# EAGLE design rapidshark-lipo-sensor-mk-1.1 (EAGLE 6.5.0)
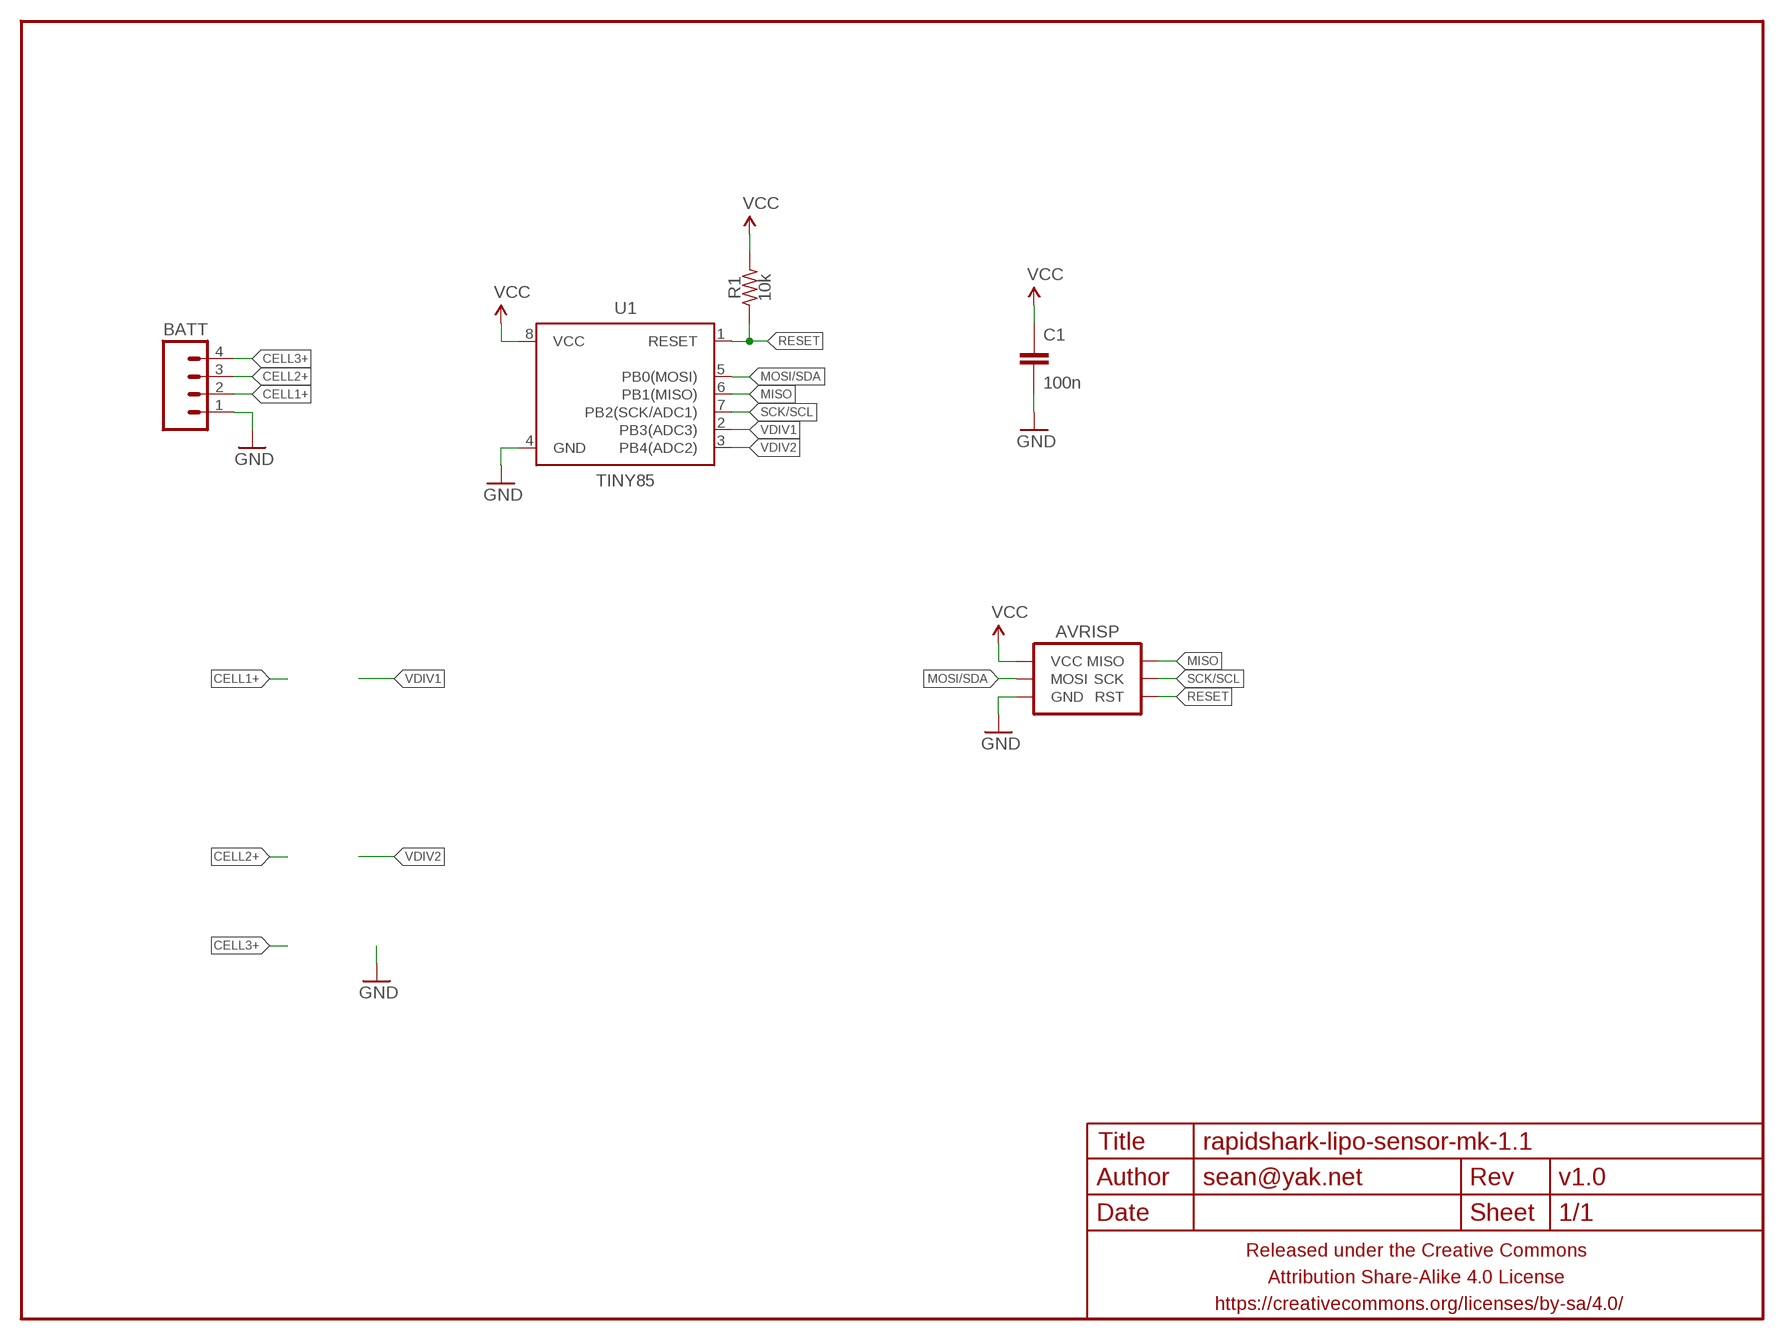
[diagram p0: schematic, sheet 1]

## Parts
AVRISP  AVR_SPI_PRG_6PTH_INLINE_I2C  [AVR_ISP_INLINE_PTH_I2C]
BATT  M04JST_XH_VERT  [JST-4-XH-VERT-TH]
C1  100n  CAPACITOR-CERAMIC025-024X044  [C025-024X044]
FRAME1  FRAME-LETTERNO_PACKAGE  [DUMMY]
R1  10k  RESISTORPTH-AXIAL-7.62MM  [RESISTOR-AXIAL-PTH-7.62MM]
U1  TINY85  ATTINY45TINY85-20-DIP  [DIP08]

## Nets
CELL1+: BATT.2
CELL2+: BATT.3
CELL3+: BATT.4
GND: AVRISP.GND BATT.1 C1.2 U1.4(GND)
MISO: AVRISP.MISO U1.6(PB1(MISO))
MOSI/SDA: AVRISP.MOSI U1.5(PB0(MOSI))
RESET: AVRISP.RESET(RST) R1.P$1 U1.1(RESET)
SCK/SCL: AVRISP.SCK U1.7(PB2(SCK/ADC1))
VCC: AVRISP.VCC C1.1 R1.P$2 U1.8(VCC)
VDIV1: U1.2(PB3(ADC3))
VDIV2: U1.3(PB4(ADC2))

## Library data of the parts
AVRISP = A_butts:AVR_SPI_PRG_6: AVR ISP 6 Pin This is the reduced ISP connector for AVR programming. Common on Arduino. This footprint will take up less PCB space and can be used with a 10-pin to 6-pin adapter such as SKU: BOB-08508 **Special note about "TEST_POINT" package. The stop mask is on the top side, so if you want your programming test points to be on the bottom of your board, make sure to place this package on the bottom side of the board. This also ensure that the orientation to program from the bottom side will be correct.
BATT = a_parts:M04: Header 4 Standard 4-pin 0.1" header. Use with straight break away headers (SKU : PRT-00116), right angle break away headers (PRT-00553), swiss pins (PRT-00743), machine pins (PRT-00117), and female headers (PRT-00115). Molex polarized connector foot print use with SKU : PRT-08231 with associated crimp pins and housings. 1MM SMD Version SKU: PRT-10208
C1 = A_butts:CAPACITOR-CERAMIC: CAPACITOR, European symbol
FRAME1 = A_butts:FRAME-LETTER: Schematic Frame Standard 8.5x11 US Letter frame; DESIGNER: sean@yak.net; VERSION: v1.0
R1 = A_butts:RESISTOR: RESISTOR, American symbol
U1 = A_butts:ATTINY45: Atmel 8-pin 2/4/8kB flash uC; PROD_ID: IC-09445; VALUE: TINY85-20-DIP

## Board
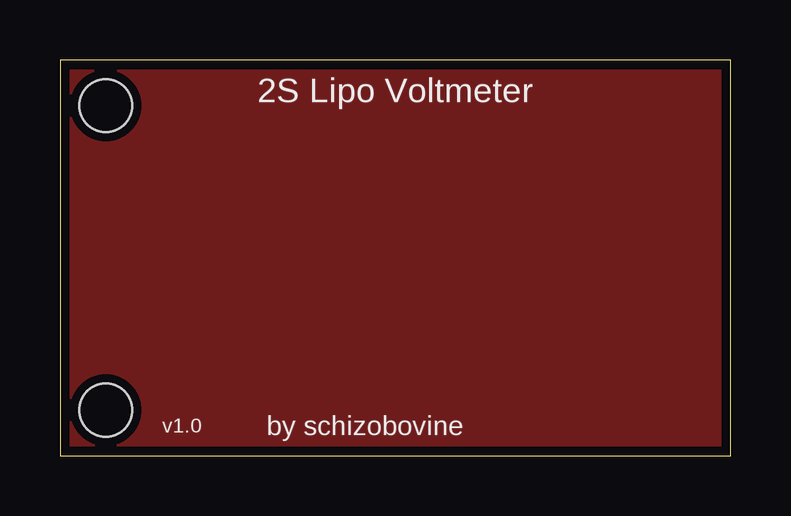
[diagram p1: board, top side]

Size 27.94 x 16.51 mm. Coordinates in mm from the lower left corner, seen from the top.
Outline: 27.94,0 27.94,16.51 0,16.51 0,0 27.94,0
Copper layers (1*16): Top 0.0356mm / dielectric 1.5011mm / Bottom 0.0356mm
Design rules "LaenPCBOrder_2": minimum track width 6mil, minimum drill 13mil, track to track 6mil, track to pad 6mil, pad to pad 6mil, via to via 6mil, smd to smd 6mil, copper to edge 15mil, drill to drill 6mil, minimum pad ring 7mil, minimum via ring 7mil, stop-mask expansion 3mil, vias tented up to drill 20mil, thermal gap 10mil
Holes 2.2 mm at 1.91,14.61 1.91,1.91

### Footprints (pad centres in the part's own frame; a part is rotated, then mirrored left to right if it is on the bottom)
AVR_ISP_INLINE_PTH_I2C = drill 0.9 pad 1.5 octagon: GND 1.27,0; MISO 3.81,0; MOSI -1.27,0; RESET 6.35,0; SCK -3.81,0; VCC -6.35,0
JST-4-XH-VERT-TH = drill 1 pad 1.676 square: 1 0,0 | drill 1 pad 1.676 octagon: 2 2.5,0; 3 5,0; 4 7.5,0
C025-024X044 = drill 0.813 pad 1.5 octagon: 1 -1.27,0; 2 1.27,0
RESISTOR-AXIAL-PTH-7.62MM = drill 0.9 pad 1.6 octagon: P$1 -3.81,0; P$2 3.81,0
DIP08 = drill 0.8 pad 1.4 octagon: 1 -3.81,-3.81; 2 -1.27,-3.81; 3 1.27,-3.81; 4 3.81,-3.81; 5 3.81,3.81; 6 1.27,3.81; 7 -1.27,3.81; 8 -3.81,3.81

### Placement (x,y rotation side)
AVRISP  6.99,-23.18 0 top  (outside the outline)
BATT  1.59,-40.01 0 top  (outside the outline)
C1  2.22,-27.3 0 top  (outside the outline)
FRAME1  0,0 0 top
R1  11.43,-26.99 0 top  (outside the outline)
U1  5.4,-13.02 0 top  (outside the outline)

### Tracks (layer width: path | path; a pad name or v marks a point on that pad's centre or on a via)
GND  (3 unrouted)
  pour Top: 0,16.51 27.94,16.51 27.94,0 0,0
MISO  (1 unrouted)
MOSI/SDA  (1 unrouted)
RESET  (2 unrouted)
SCK/SCL  (1 unrouted)
VCC  (3 unrouted)

### Text on the board
tPlace: 2S Lipo Voltmeter | by schizobovine